# Altium schematic sheet SCH_人脸识别TX510和考勤_2025-04-04.schdoc
size 242 x 191 mm
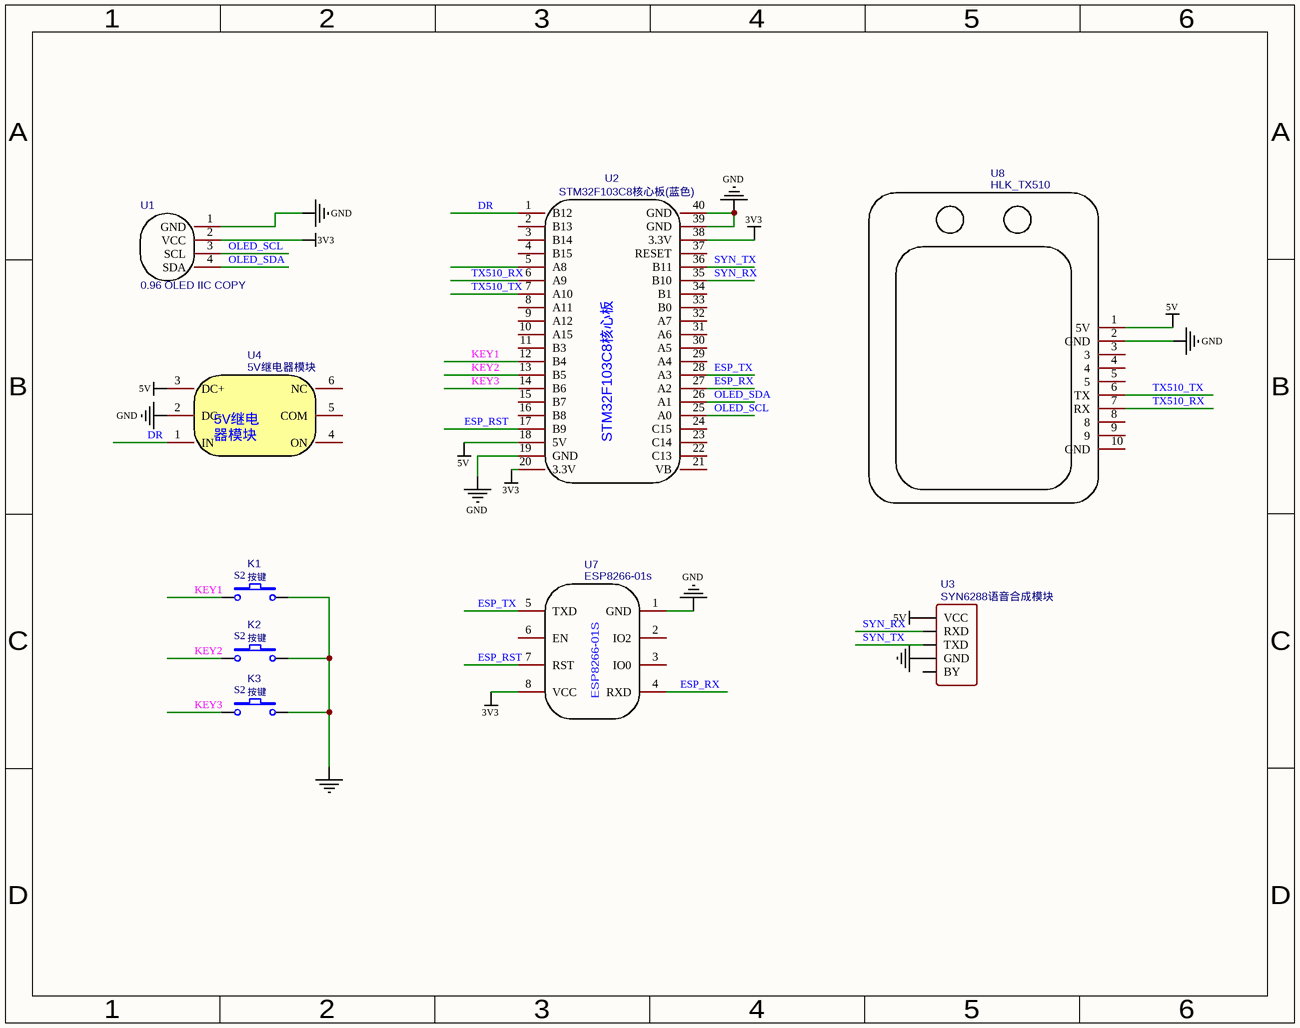
[diagram p0: SCH_人脸识别TX510和考勤_2025-04-04.schdoc]

## Parts
K1  按键  [KEY-TH_4P复位按键]
K2  按键  [KEY-TH_4P复位按键]
K3  按键  [KEY-TH_4P复位按键]
U1  0.96 OLED IIC COPY  [OLED-TH_OLED0.96-IIC]
U2  STM32F103C8核心板(蓝色)  [STM32F103C8T6核心板]
U3  SYN6288语音合成模块  [SYN6288语音合成模块]
U4  5V继电器模块  [5V继电器模块]
U7  ESP8266-01s  [ESP8266-01S]
U8  HLK_TX510  [TX510]

## Nets
3V3: U1.2(VCC) U2.20(3.3V) U2.38(3.3V) U7.8(VCC)
5V: U2.18(5V) U3.1(VCC) U4.3(DC+) U8.1(5V)
GND: K1.3 K2.3 K3.3 U1.1(GND) U2.19(GND) U2.39(GND) U2.40(GND) U3.4(GND) U4.2(DC-) U7.1(GND) U8.2(GND)
DR: U2.1(B12) U4.1(IN)
ESP_RST: U2.17(B9) U7.7(RST)
ESP_RX: U2.27(A2) U7.4(RXD)
ESP_TX: U2.28(A3) U7.5(TXD)
KEY1: K1.1 U2.12(B4)
KEY2: K2.1 U2.13(B5)
KEY3: K3.1 U2.14(B6)
OLED_SCL: U1.3(SCL) U2.25(A0)
OLED_SDA: U1.4(SDA) U2.26(A1)
SYN_RX: U2.35(B10) U3.2(RXD)
SYN_TX: U2.36(B11) U3.3(TXD)
TX510_RX: U2.6(A9) U8.7(RX)
TX510_TX: U2.7(A10) U8.6(TX)

Not connected (* = marked no-connect by the designer): U2 2(B13) 3(B14) 4(B15) 5(A8) 8(A11) 9(A12) 10(A15) 11(B3) 15(B7) 16(B8) 21(VB) 22(C13) 23(C14) 24(C15) 29(A4) 30(A5) 31(A6) 32(A7) 33(B0) 34(B1) 37(RESET); U3 5(BY); U4 4(ON) 5(COM) 6(NC); U7 2(IO2) 3(IO0) 6(EN); U8 3 4 5 8 9 10(GND)

## Notes on the sheet
- (in symbol 5V继电器模块) 5V继电 / 器模块
- (in symbol ESP8266-01s) ESP8266-01S
- (in symbol STM32F103C8核心板(蓝色)) STM32F103C8核心板
- (in symbol 按键) S2

## Library data of the parts
K1-K3 = 按键: Contributor: tongtongll; spiceSymbolName: 按键
  K1: spicePre: K
  K2 K3: spicePre: U
U1 = 0.96 OLED IIC COPY: Contributor: 0errors0warning; spicePre: U; spiceSymbolName: 0.96 OLED IIC COPY
U2 = STM32F103C8核心板(蓝色): Contributor: JINZH; spicePre: U; spiceSymbolName: STM32F103C8核心板(蓝色)
U3 = SYN6288语音合成模块: Contributor: qq757683348; spicePre: U; spiceSymbolName: SYN6288语音合成模块
U4 = 5V继电器模块: Contributor: zxt_esp8266; spicePre: U; spiceSymbolName: 5V继电器模块
U7 = ESP8266-01s: Contributor: weidu; spicePre: U; spiceSymbolName: ESP8266-01s
U8 = HLK_TX510: Contributor: flyinglab; Package Display: No; spicePre: U; spiceSymbolName: HLK_TX510